# Altium project VLC.PrjPcb
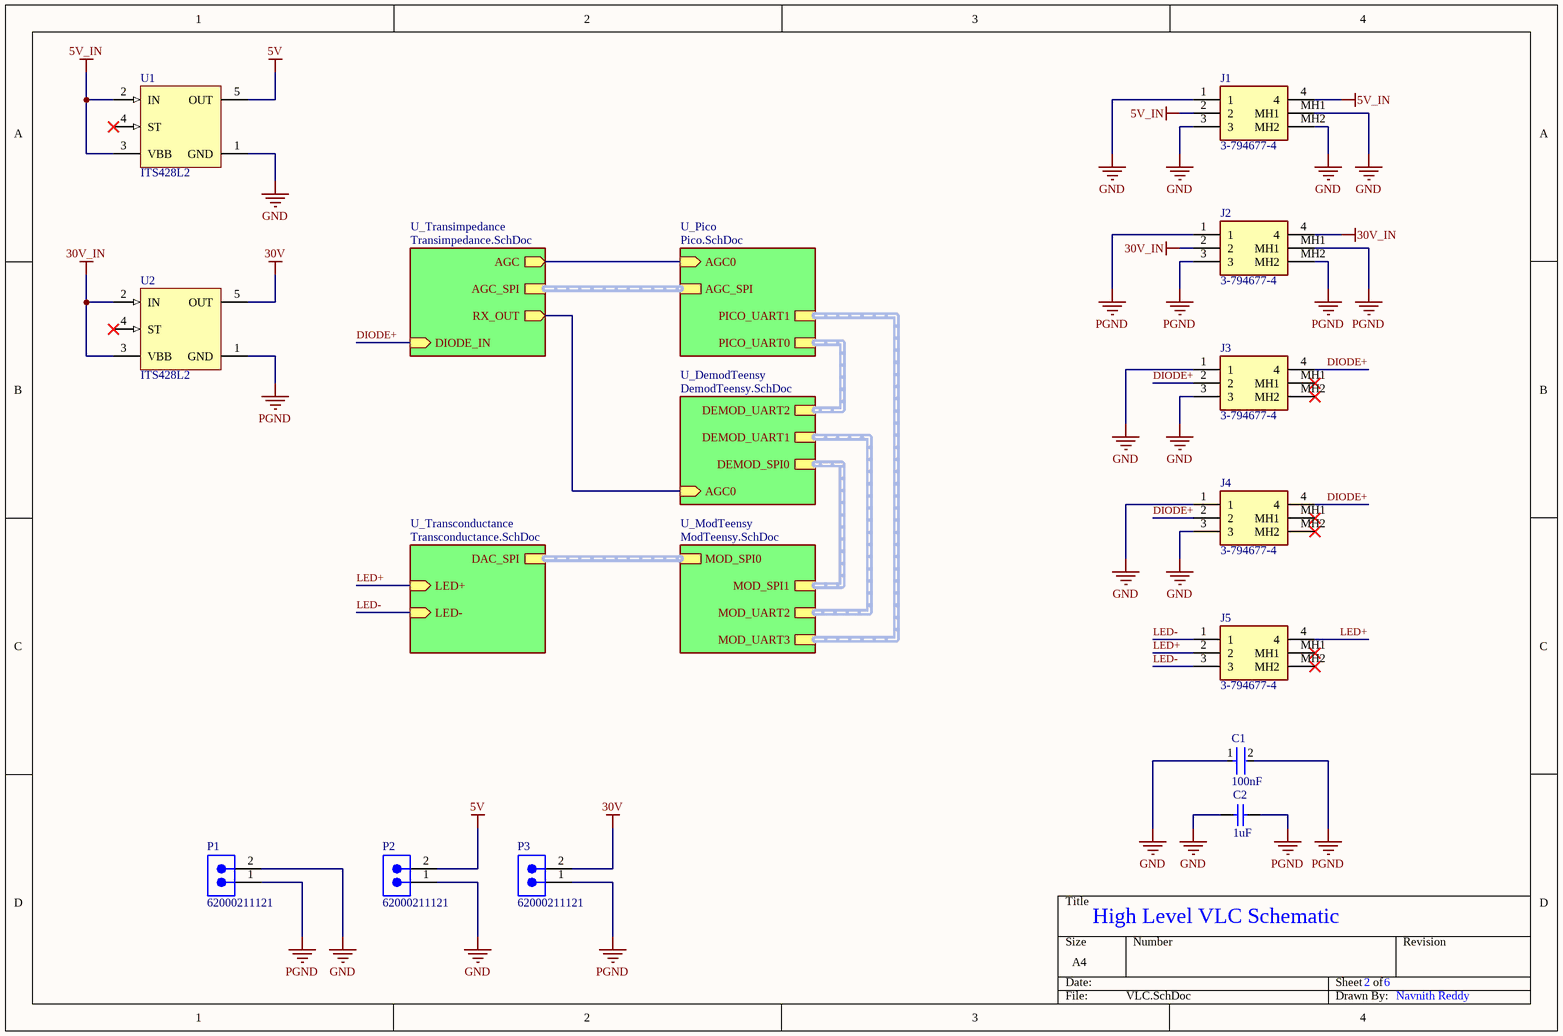
[diagram p0: VLC.SchDoc]
6 sheets, 71 parts. Net scope: hierarchical (ports join the sheet entries above them; power ports are global).
Board file: VLC.PcbDoc
Sheets:
  VLC.SchDoc
    U_Pico = Pico.SchDoc
    U_Transimpedance = Transimpedance.SchDoc
    U_DemodTeensy = DemodTeensy.SchDoc
    U_Transconductance = Transconductance.SchDoc
    U_ModTeensy = ModTeensy.SchDoc

## Sheet VLC.SchDoc
size A4; SheetNumber: 1; SheetTotal: 6

### Parts
C1  100nF  [FP-C0805C-DN-MFG]
C2  1uF  [CAPC2013X145X50LL20T25]
J1  3-794677-4  [37946774]
J2  3-794677-4  [37946774]
J3  3-794677-4  [37946774]
J4  3-794677-4  [37946774]
J5  3-794677-4  [37946774]
P1  62000211121  [62000211121]
P2  62000211121  [62000211121]
P3  62000211121  [62000211121]
U1  ITS428L2  [INF-PG-TO252-5-11_M]
U2  ITS428L2  [INF-PG-TO252-5-11_M]

### Sub-sheets
U_DemodTeensy = DemodTeensy.SchDoc: AGC0 (in), DEMOD_UART1 (harness M_UART2), DEMOD_UART2 (harness D_UART2), DEMOD_SPI0 (harness D_SPI0)
U_ModTeensy = ModTeensy.SchDoc: MOD_UART2 (harness M_UART2), MOD_UART3 (harness M_UART3), MOD_SPI0 (harness M_SPI0), MOD_SPI1 (harness M_SPI1)
U_Pico = Pico.SchDoc: AGC0 (in), PICO_UART1 (harness M_UART3), PICO_UART0 (harness D_UART2), AGC_SPI (harness PICO_SPI1)
U_Transconductance = Transconductance.SchDoc: LED+ (in), LED- (in), DAC_SPI (harness SPI)
U_Transimpedance = Transimpedance.SchDoc: AGC (out), DIODE_IN (in), AGC_SPI (harness SPI_0), RX_OUT (out)

### Nets
5V: P2.2 U1.5(OUT)
5V_IN: J1.2 J1.4 U1.2(IN) U1.3(VBB)
30V_IN: J2.2 J2.4 U2.2(IN) U2.3(VBB)
GND: C1.1 C2.2 J1.1 J1.3 J1.MH1 J1.MH2 J3.1 J3.3 J4.1 J4.3 P1.2 P2.1 U1.1(GND)
LED+: J5.2 J5.4 P3.2 U2.5(OUT) ; sheet U_Transconductance/LED+  [also labelled 30V]
PGND: C1.2 C2.1 J2.1 J2.3 J2.MH1 J2.MH2 P1.1 P3.1 U2.1(GND)
D14: sheet U_Pico/AGC0, sheet U_Transimpedance/AGC, sheet U_Transimpedance/RX_OUT, sheet U_DemodTeensy/AGC0
DIODE+: J3.2 J3.4 J4.2 J4.4 ; sheet U_Transimpedance/DIODE_IN
LED-: J5.1 J5.3 ; sheet U_Transconductance/LED-

Not connected (* = marked no-connect by the designer): J3 MH1* MH2*; J4 MH1* MH2*; J5 MH1* MH2*; U1 4(ST)*; U2 4(ST)*

### Buses and harness runs
harness sheet U_DemodTeensy/DEMOD_SPI0 = sheet U_ModTeensy/MOD_SPI1
harness sheet U_DemodTeensy/DEMOD_UART1 = sheet U_ModTeensy/MOD_UART2
harness sheet U_DemodTeensy/DEMOD_UART2 = sheet U_Pico/PICO_UART0
harness sheet U_ModTeensy/MOD_SPI0 = sheet U_Transconductance/DAC_SPI
harness sheet U_ModTeensy/MOD_UART3 = sheet U_Pico/PICO_UART1
harness sheet U_Pico/AGC_SPI = sheet U_Transimpedance/AGC_SPI

### Notes on the sheet
- High Level VLC Schematic
- 2
- 6
- Navnith Reddy

### Library data of the parts
C1 = CMP-2007-00274-2: CAP CER 0.1UF 16V X7R 0805; Manufacturer Part Number: C0805C104K4RACTU; Manufacturer: KEMET; Material: Ceramic; Tolerance: 0.1; Capacitance: 0.10 μF; Value: 0.10 μF; Temperature Coefficient: 30ppm/°C; Device Class L3: Ceramic Capacitors; RoHS: TRUE; Octopart: https://octopart.com/c0805c104k4ractu-kemet-92155; ComponentLink2Description: Datasheet; ComponentLink2URL: https://content.kemet.com/datasheets/KEM_C1003_C0G_SMD.pdf; Temperature Range High: +125°C; Category: Cap; Lead Free: Yes; Digikey Description: CAP CER 0.1UF 16V X7R 0805; Automotive: No; Temperature Range Low: -55°C; Voltage Rating: 16 V; Package: C0805C-DN; Ipc Land Pattern Name: CAPC200125X78; Height: 0.88mm; Device Class L1: Passive Components; Temperature: -55°C to +125°C; Mouser Description: Multilayer Ceramic Capacitors MLCC - SMD/SMT 16volts 0.1uF X7R 10%; Device Class L2: Capacitors; Temperature Characteristic: X7R
C2 = CMP-1036-04746-2: Manufacturer: Kemet; Part Number: C0805C105K4PACTU
J1-J5 = 3-794677-4: Connector; Manufacturer_Name: TE Connectivity; Datasheet Link: https://www.te.com/commerce/DocumentDelivery/DDEController?Action=srchrtrv&DocNm=micro-mate-n-lok-connector-qrg&DocType=Data%20Sheet&DocLang=English&PartCntxt=3-794677-4&DocFormat=pdf; Height: 8.67mm; Manufacturer_Part_Number: 3-794677-4; Mouser Part Number: 571-3-794677-4; Mouser Price/Stock: https://www.mouser.co.uk/ProductDetail/TE-Connectivity-AMP/3-794677-4?qs=6xDM53S3Z3IXPJK6%252BrOgPw%3D%3D; Arrow Part Number: 3-794677-4; Arrow Price/Stock: https://www.arrow.com/en/products/3-794677-4/te-connectivity?region=europe
P1-P3 = CMP-1502-00956-3: NexarPartId: 61924778; Number of Contacts: 2; Voltage Rating: 200V; Gender: Male; Contact Resistance: 20mΩ; Current Rating: 2A; Lead Pitch: 2mm; Max Operating Temperature: 105°C; Contact Material: Gold; Number of Rows: 1; Operating Supply Voltage: 200V; Number of Pins: 2; Orientation: Vertical; Min Operating Temperature: -40°C; Height: 6.35mm; RoHS: Non-Compliant
U1 U2 = CMP-1095-00118-1: Smart High-Side Power Switch for Industrial Applications 1 Channel: 60 mOhm Status Feedback, 4.75 to 41 V Operating, -30 to 85 degC, PG-TO252-5-11, Reel, Green; Manufacturer: Infineon; IL (nom)min - one channel active: 5.8Â A; Ptot (max): 75 W; toff (max): 200 us; Green: TRUE; RON @ 25 degC: 60 mOhm (max); Channels: 1; RON (max) @ Tj max: 120 mOhm; Operating Voltage Range (min): 4.75Â V; IL (SC): 22 A; Operating Voltage Range (max): 41 V; Diagnostic: Digital; ComponentLink2Description: Datasheet; PackageVersion: Nov-10; PartNumber: ITS428L2; PackageDescription: 5-Pin Plastic (Green) Transistor Single Outline Package, 6.5 x 6.12 mm Body, 1.14 mm Pitch; ComponentLink2URL: http://www.infineon.com/dgdl/ITS428L2_DS11_20081010.pdf?folderId=db3a304314dca389011537739e37155f&fileId=db3a30431c69a49d011cdcc9a1fd41df; DatasheetVersion: Rev. 1.1; IL (nom)min - all channels active: 5.8Â A; PackageReference: PG-TO252-5-11; ton (max): 200 us; Mounting Technology: Surface Mount; ComponentLink3Description: Package Specification; Load Current (typ): 5.8Â A; Packing: Reel; Halogen-free: TRUE; ComponentLink1Description: Manufacturer URL; ComponentLink1URL: http://www.infineon.com/; ComponentLink3URL: http://www.infineon.com/dgdl/TLE7276-Data+Sheet-+v1_11.pdf?folderId=db3a304412b407950112b408e8c90004&fileId=db3a304412b407950112b436c53f66c8&sId=db3a30433db6f09f013dc0e43c0428c1; IL (SCp): 22 A

## Sheet Pico.SchDoc
size A4; SheetNumber: 4; SheetTotal: 6
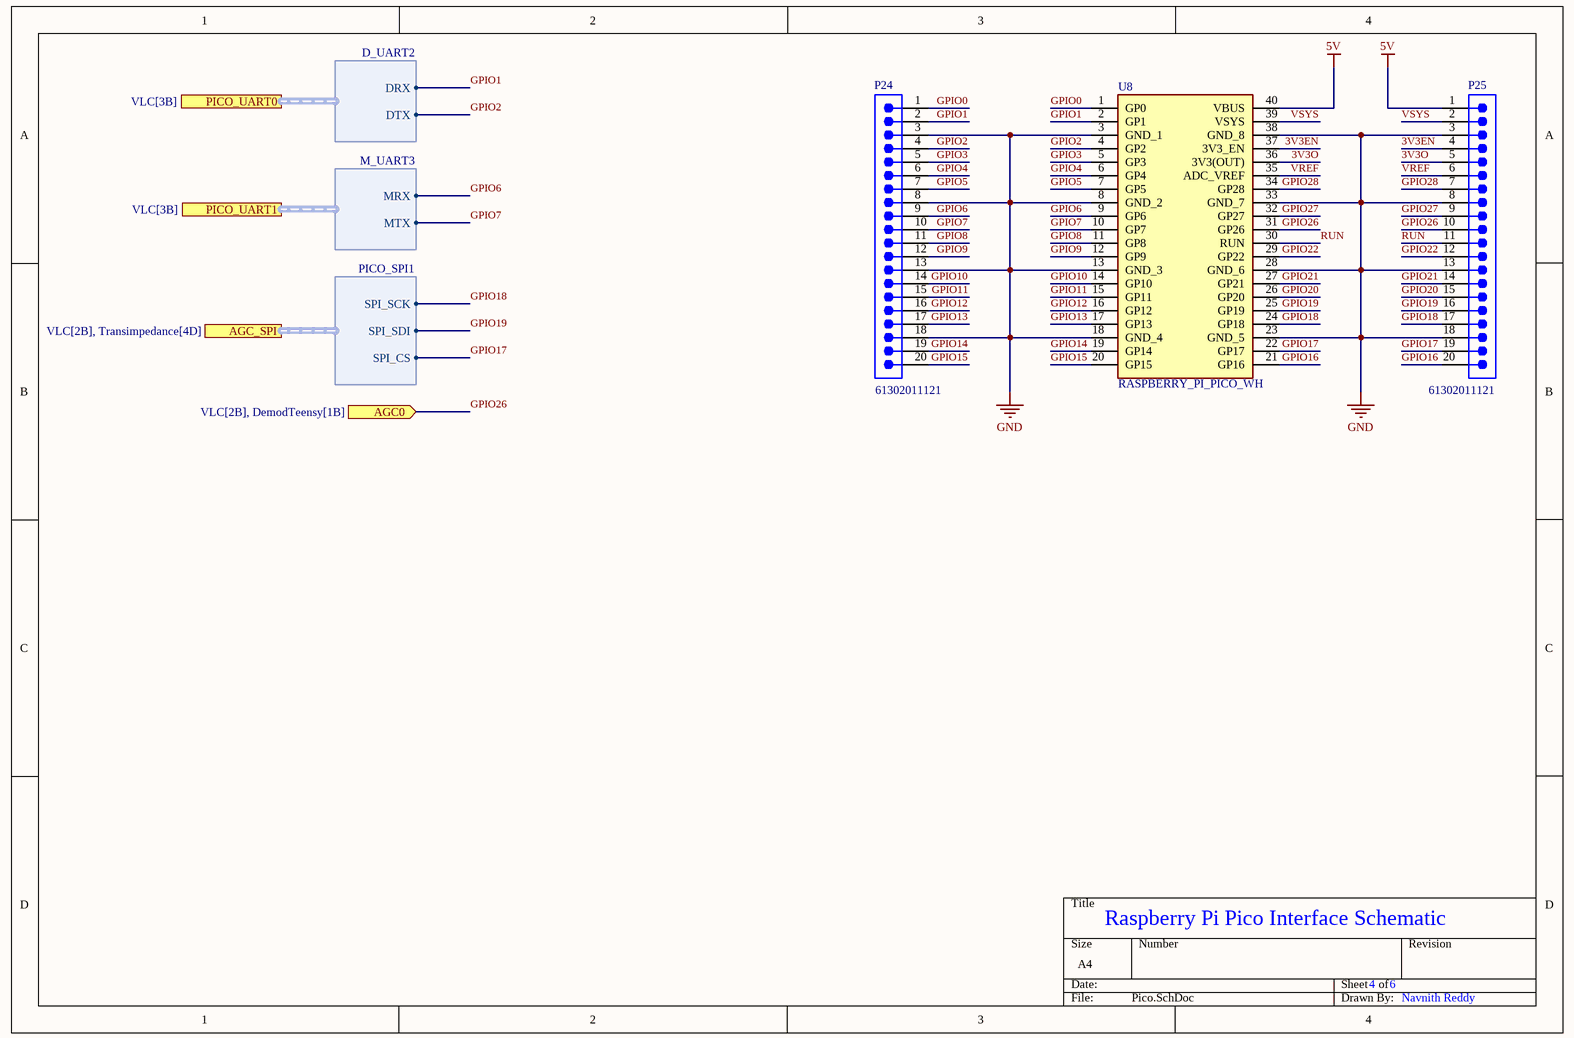
[diagram p1: Pico.SchDoc]

### Parts
P24  61302011121  [61302011121]
P25  61302011121  [61302011121]
U8  RASPBERRY_PI_PICO_WH  [RASPBERRYPIPICOWH]

### Ports
AGC0 (in, see VLC[2B], DemodTeensy[1B]), AGC_SPI (harness PICO_SPI1, see VLC[2B], Transimpedance[4D]), PICO_UART0 (harness D_UART2, see VLC[3B]), PICO_UART1 (harness M_UART3, see VLC[3B])

### Harnesses
PICO_SPI1: SPI_SCK, SPI_SDI, SPI_CS
M_UART3: MRX, MTX
D_UART2: DRX, DTX

### Nets
5V: P25.1 U8.40(VBUS)
GND: P24.3 P24.8 P24.13 P24.18 P25.3 P25.8 P25.13 P25.18 U8.3(GND_1) U8.8(GND_2) U8.13(GND_3) U8.18(GND_4) U8.23(GND_5) U8.28(GND_6) U8.33(GND_7) U8.38(GND_8)
3V3EN: P25.4 U8.37(3V3_EN)
3V3O: P25.5 U8.36(3V3(OUT))
GPIO0: P24.1 U8.1(GP0)
GPIO1: P24.2 U8.2(GP1) ; port PICO_UART0.DRX  [project net D7]
GPIO2: P24.4 U8.4(GP2) ; port PICO_UART0.DTX  [project net D8]
GPIO3: P24.5 U8.5(GP3)
GPIO4: P24.6 U8.6(GP4)
GPIO5: P24.7 U8.7(GP5)
GPIO6: P24.9 U8.9(GP6) ; port PICO_UART1.MRX
GPIO7: P24.10 U8.10(GP7) ; port PICO_UART1.MTX
GPIO8: P24.11 U8.11(GP8)
GPIO9: P24.12 U8.12(GP9)
GPIO10: P24.14 U8.14(GP10)
GPIO11: P24.15 U8.15(GP11)
GPIO12: P24.16 U8.16(GP12)
GPIO13: P24.17 U8.17(GP13)
GPIO14: P24.19 U8.19(GP14)
GPIO15: P24.20 U8.20(GP15)
GPIO16: P25.20 U8.21(GP16)
GPIO17: P25.19 U8.22(GP17) ; port AGC_SPI.SPI_CS
GPIO18: P25.17 U8.24(GP18) ; port AGC_SPI.SPI_SCK
GPIO19: P25.16 U8.25(GP19) ; port AGC_SPI.SPI_SDI
GPIO20: P25.15 U8.26(GP20)
GPIO21: P25.14 U8.27(GP21)
GPIO22: P25.12 U8.29(GP22)
GPIO26: P25.10 U8.31(GP26) ; port AGC0  [project net D14]
GPIO27: P25.9 U8.32(GP27)
GPIO28: P25.7 U8.34(GP28)
RUN: P25.11 U8.30(RUN)
VREF: P25.6 U8.35(ADC_VREF)
VSYS: P25.2 U8.39(VSYS)

### Notes on the sheet
- Raspberry Pi Pico Interface Schematic
- 4
- 6
- Navnith Reddy

### Library data of the parts
P24 P25 = CMP-1502-01102-2: NexarPartId: 32855554; Number of Contacts: 20; Contact Resistance: 20mΩ; Pitch: 2.54mm; Gender: Male; Operating Supply Voltage: 250V; Connector Type: Male Pin; Current Rating: 3A; Packaging: Bulk; RoHS: Compliant; Contact Material: Copper; Contact Mating Length: 5.9944mm; Number of Positions: 20; Orientation: Vertical; Termination: Solder; Number of Pins: 20; Color: Black; REACH SVHC: Unknown; Mount: Through Hole; Contact Plating: Gold; Number of Rows: 1; Lead Pitch: 2.54mm
U8 = RASPBERRY_PI_PICO_WH: Undefined or Miscellaneous; Manufacturer_Name: RASPBERRY-PI; Manufacturer_Part_Number: RASPBERRY PI PICO WH; Datasheet Link: https://datasheets.raspberrypi.com/picow/pico-w-datasheet.pdf; Height: 4mm

## Sheet Transimpedance.SchDoc
size A4; SheetNumber: 6; SheetTotal: 6
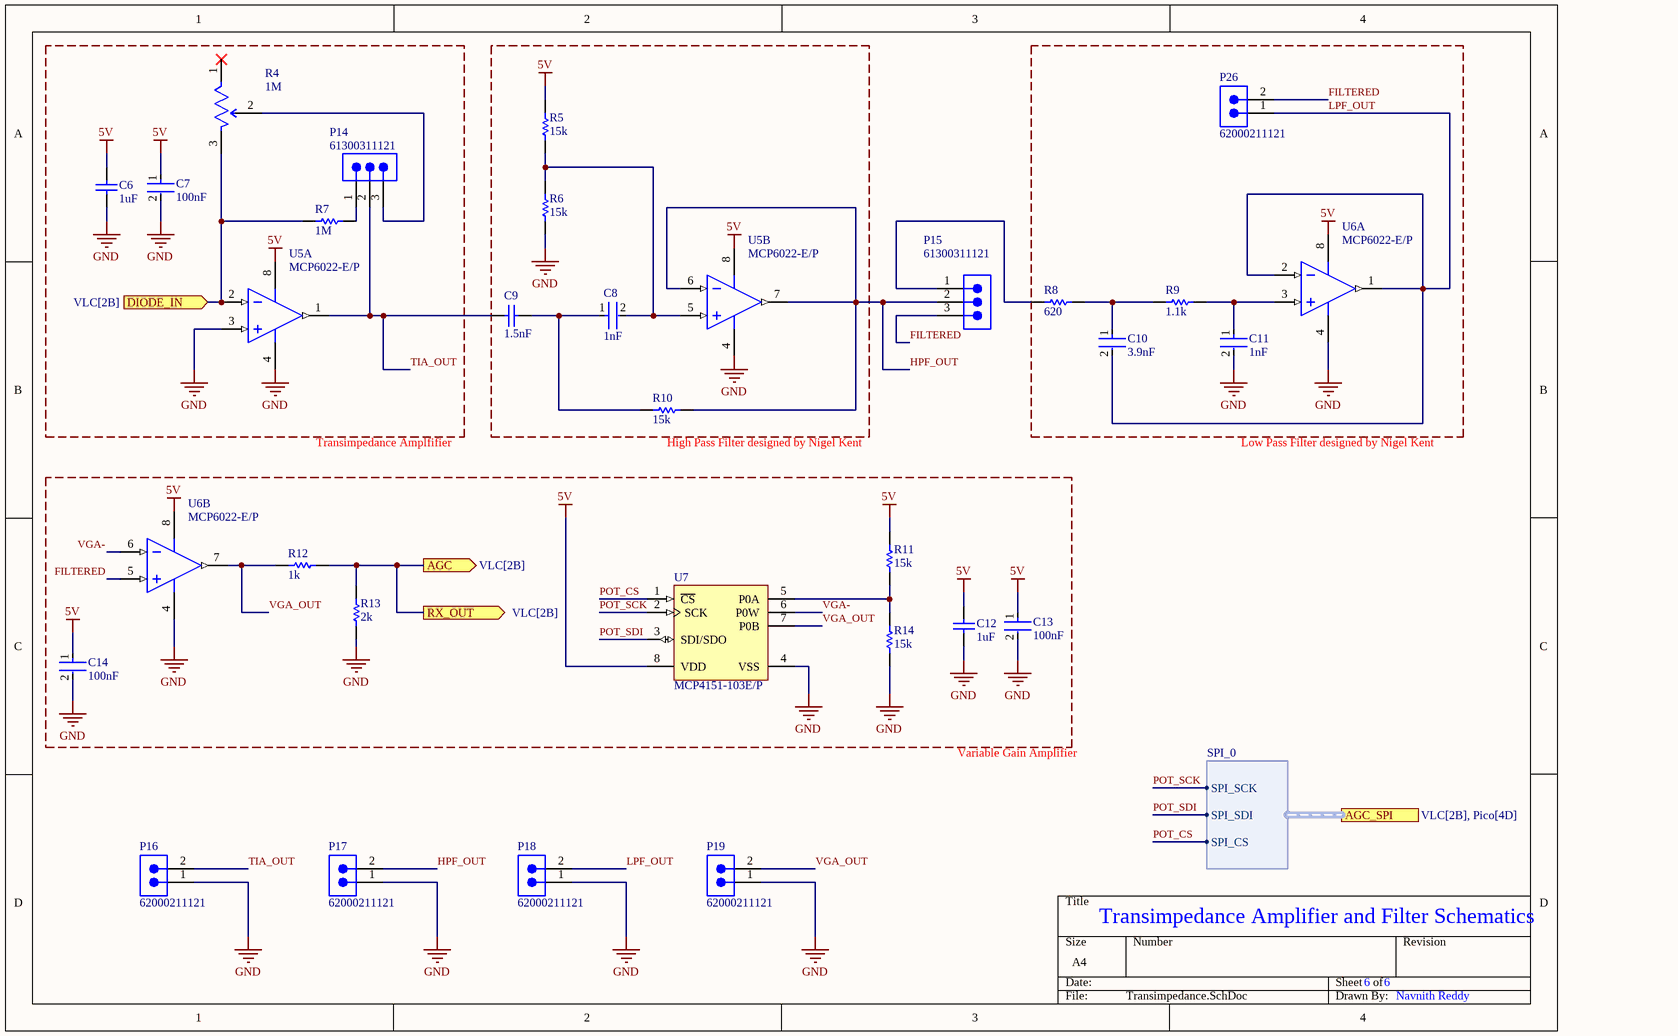
[diagram p2: Transimpedance.SchDoc]

### Parts
C6  1uF  [CAPC2013X145X50LL20T25]
C7  100nF  [FP-C0805C-DN-MFG]
C8  1nF  [FP-0805-L_2_01_0_2-W_1_25-IPC_C]
C9  1.5nF  [CAPC2013X94X50ML20T25]
C10  3.9nF  [FP-C0805C-DN-MFG]
C11  1nF  [FP-0805-L_2_01_0_2-W_1_25-IPC_C]
C12  1uF  [CAPC2013X145X50LL20T25]
C13  100nF  [FP-C0805C-DN-MFG]
C14  100nF  [FP-C0805C-DN-MFG]
P14  61300311121  [61300311121]
P15  61300311121  [61300311121]
P16  62000211121  [62000211121]
P17  62000211121  [62000211121]
P18  62000211121  [62000211121]
P19  62000211121  [62000211121]
P26  62000211121  [62000211121]
R4  1M  [FP-3296W-MFG]
R5  15k  [RESC2013X55X40NL15T20]
R6  15k  [RESC2013X55X40NL15T20]
R7  1M  [RESC2013X60X40LL20T25]
R8  620  [RESC2013X70X40LL20T20]
R9  1.1k  [RESC2013X50X30LL20T20]
R10  15k  [RESC2013X55X40NL15T20]
R11  15k  [RESC2013X55X40NL15T20]
R12  1k  [RESC2013X70X40ML20T20]
R13  2k  [RESC2013X70X40ML20T20]
R14  15k  [RESC2013X55X40NL15T20]
U5  MCP6022-E/P  [PDIP300-P8]  (parts A,B of 2)
U6  MCP6022-E/P  [PDIP300-P8]  (parts A,B of 2)
U7  MCP4151-103E/P  [PDIP300-P8]

### Ports
AGC (out, see VLC[2B]), AGC_SPI (harness SPI_0, see VLC[2B], Pico[4D]), DIODE_IN (in, see VLC[2B]), RX_OUT (out, see VLC[2B])

### Harnesses
SPI_0: SPI_SCK, SPI_SDI, SPI_CS

### Nets
5V: C6.2 C7.1 C12.2 C13.1 C14.1 R5.2 R11.2 U5.8(VDD) U6.8(VDD) U7.8(VDD)
GND: C6.1 C7.2 C11.2 C12.1 C13.2 C14.2 P16.1 P17.1 P18.1 P19.1 R6.1 R13.1 R14.1 U5.3(VINA+) U5.4(VSS) U6.4(VSS) U7.4(VSS)
D14: R12.2 R13.2 ; port AGC, port RX_OUT
DIODE+: R4.3(CW) R7.1 U5.2(VINA-) ; port DIODE_IN
FILTERED: P15.3 P26.2 U6.5(VINB+)
HPF_OUT: P15.2 P17.2 R10.2 U5.6(VINB-) U5.7(VOUTB)
LPF_OUT: C10.2 P18.2 P26.1 U6.1(VOUTA) U6.2(VINA-)
POT_CS: U7.1(~{CS}) ; port AGC_SPI.SPI_CS  [project net GPIO17]
POT_SCK: U7.2(SCK) ; port AGC_SPI.SPI_SCK  [project net GPIO18]
POT_SDI: U7.3(SDI/SDO) ; port AGC_SPI.SPI_SDI  [project net GPIO19]
TIA_OUT: C9.1 P14.2 P16.2 U5.1(VOUTA)
VGA-: U6.6(VINB-) U7.6(P0W)
VGA_OUT: P19.2 R12.1 U6.7(VOUTB) U7.7(P0B)
NetC8_1: C8.1 C9.2 R10.1
NetC8_2: C8.2 R5.1 R6.2 U5.5(VINB+)
NetC10_1: C10.1 R8.2 R9.1
NetC11_1: C11.1 R9.2 U6.3(VINA+)
NetP14_1: P14.1 R7.2
NetP14_3: P14.3 R4.2(WIPER)
NetP15_1: P15.1 R8.1
NetR11_1: R11.1 R14.2 U7.5(P0A)

Not connected (* = marked no-connect by the designer): R4 1(CCW)*

### Notes on the sheet
- Transimpedance Amplfifier
- (near R10) High Pass Filter designed by Nigel Kent
- Low Pass Filter designed by Nigel Kent
- Variable Gain Amplifier
- Transimpedance Amplifier and Filter Schematics
- 6
- Navnith Reddy

### Library data of the parts
C6 C12 = CMP-1036-04746-2: as C2 on sheet VLC
C7 C13 C14 = CMP-2007-00274-2: as C1 on sheet VLC; Device Class L3: Ceramic Capacitors; RoHS: TRUE; Octopart: https://octopart.com/c0805c104k4ractu-kemet-92155; ComponentLink2Description: Datasheet; ComponentLink2URL: https://content.kemet.com/datasheets/KEM_C1003_C0G_SMD.pdf; Temperature Range High: +125°C; Category: Cap; Lead Free: Yes; Digikey Description: CAP CER 0.1UF 16V X7R 0805; Automotive: No; Temperature Range Low: -55°C; Voltage Rating: 16 V; Package: C0805C-DN; Ipc Land Pattern Name: CAPC200125X78; Height: 0.88mm; Device Class L1: Passive Components; Temperature: -55°C to +125°C; Mouser Description: Multilayer Ceramic Capacitors MLCC - SMD/SMT 16volts 0.1uF X7R 10%; Device Class L2: Capacitors; Temperature Characteristic: X7R
C8 C11 = CMP-1036-02979-3: General Purpose Ceramic Capacitor, 0805, 1nF, 10%, X7R, 0.15, 50V; Dissipation Factor: 2.5%; Insulation Resistance: 100GR; Radiation Hardening: No; Case Code (Imperial): 0805; Packaging: Tape and Reel; Height: 0.94mm; Number of Pins: 2; REACH SVHC: No SVHC; Case Code (Metric): 2012; Voltage: 50V; Max Operating Temperature: 125°C; Tolerance: 10%; Voltage Rating: 50V; Depth: 1.25mm; Voltage Rating (DC): 50V; Thickness: 0.037inch; Termination: SMD/SMT; Package Quantity: 1; RoHS Compliant: Yes; Mount: Surface Mount; Dielectric: X7R; Length: 2.01mm; Contact Plating: Tin; Lead Free: Lead Free; Case/Package: 0805; Width: 1.25mm; Capacitance: 1nF; Dielectric Material: Ceramic; Min Operating Temperature: -55°C
C9 = CMP-2007-04179-1: Manufacturer: AVX Interconnect / Elco; Part Number: 08051C152KAT2A
C10 = CMP-2007-03730-2: CAP CER 3900PF 200V C0G/NP0 0805; Manufacturer Part Number: C0805C392J2GACAUTO; Manufacturer: KEMET; Temperature Characteristic: C0G; Value: 3,900 pF; Material: Ceramic; Tolerance: 0.05; Temperature Coefficient: 30ppm/°C; Category: Cap; Lead Free: Yes; Device Class L1: Passive Components; Temperature Range Low: -55°C; Temperature Range High: +125°C; Height: 0.88mm; Voltage Rating: 200 V; Device Class L2: Capacitors; Octopart: https://octopart.com/c0805c392j2gacauto-kemet-46733246; Capacitance: 3,900 pF; Temperature: -55°C to +125°C; Ipc Land Pattern Name: CAPC200125X78; Automotive: No; Digikey Description: CAP CER 3900PF 200V C0G/NP0 0805; ComponentLink2URL: https://content.kemet.com/datasheets/KEM_C1003_C0G_SMD.pdf; Device Class L3: Ceramic Capacitors; Package: C0805C-DN; RoHS: TRUE; ComponentLink2Description: Datasheet
P14 P15 = CMP-1502-01062-2: NexarPartId: 32855521; Voltage Rating: 250V; Current Rating: 3A; Connector Type: Male Pin; Number of Positions: 3; Gender: Male; Contact Resistance: 20mΩ; Pitch: 2.54mm; Max Operating Temperature: 105°C; Lead Pitch: 2.54mm; Lead Free: Lead Free; Contact Mating Length: 5.9944mm; Contact Material: Copper; Number of Pins: 3; Orientation: Vertical; Height: 8.94mm; Packaging: Bulk; Min Operating Temperature: -40°C; Mount: Through Hole; RoHS: Compliant; Number of Contacts: 3; Operating Supply Voltage: 250V; Termination: Solder; Number of Rows: 1; Contact Plating: Gold; Color: Black; REACH SVHC: Unknown
P16-P19 P26 = CMP-1502-00956-3: as P1 on sheet VLC; Lead Pitch: 2mm; Max Operating Temperature: 105°C; Contact Material: Gold; Number of Rows: 1; Operating Supply Voltage: 200V; Number of Pins: 2; Orientation: Vertical; Min Operating Temperature: -40°C; Height: 6.35mm; RoHS: Non-Compliant
R4 = CMP-07234-000048-1: TRIMMER 200K OHM 0.5W PC PIN TOP; Resistance Tolerance: 10%; Number of Turns: 25; Temperature Coefficient: 100ppm/°C; Power Rating: 500mW; Resistance: 200kR; Resistor Type: Cermet; Color: Blue; Radiation Hardening: No; RoHS Compliant: Yes; Taper: Linear; Technology: CERMET; Mount: Panel; Packaging: Rail/Tube; Lead Free: Lead Free; Tolerance: 10%; Min Operating Temperature: -55°C; Depth: 4.83mm; Length: 9.53mm; Width: 9.53mm; REACH SVHC: No SVHC; Package Quantity: 50; Height: 0.395inch; Max Power Dissipation: 500mW; Max Operating Temperature: 125°C; Military Standard: Not; Termination: Pin; Contact Plating: Tin; Series: 3296; Weight: 0.03oz
R5 R6 R10 R11 R14 = CMP-2001-04735-1: Part Number: TNPW080515K0BEEA; Manufacturer: Vishay Dale
R7 = CMP-2001-00584-1: Part Number: ERA-6AEB105V; Manufacturer: Panasonic
R8 = CMP-2001-00436-1: Manufacturer: Panasonic; Part Number: ERJ-6GEYJ621V
R9 = CMP-1013-00514-2: Part Number: CRCW08051K10FKTA; Manufacturer: Vishay Dale
R12 = CMP-2001-04375-5: Chip Resistor, 1 KOhm, +/- 1%, 0.125 W, -55 to 155 degC, 0805 (2012 Metric), RoHS, Tape and Reel; Manufacturer: Panasonic; Voltage Rating: 150 V; ComponentLink1URL: http://www.panasonic.com/; ComponentLink2Description: Datasheet; REACH SVHC: Yes; ComponentLink1Description: Manufacturer URL; Length: 2 mm; Height: 0.6 mm; Package Quantity: 1; PackageDescription: 2-Pin Surface Mount Device, Body 2 x 1.25 mm; Packaging: Cut Tape; PackageReference: 0805; Max Operating Temperature: 155 degC; Mounting Technology: Surface Mount; ComponentLink2URL: http://industrial.panasonic.com/cdbs/www-data/pdf/RDA0000/AOA0000C86.pdf; DatasheetVersion: 04/2015; Min Operating Temperature: -55 degC; RoHSCompliant: true; Mount: Surface Mount
R13 = CMP-2001-00370-1: Part Number: ERJ-6GEYJ202V; Manufacturer: Panasonic
U5 U6 = CMP-0187-00090-3: None; Max Supply Voltage: 5.5V; Voltage Gain: 110dB; Input Bias Current: 5nA; Bandwidth: 10MHz; Number of Elements: 2; Min Supply Voltage: 2.5V; Input Offset Voltage-Max: 500uV; Power Supply Rejection Ratio (PSRR): 74dB; Nominal Supply Current: 1mA; Input Offset Voltage (Vos): 250uV; Amplifier Type: GENERAL PURPOSE; Common Mode Rejection Ratio: 70dB; Slew Rate-Nom: 7V/µs; Output Current: 22mA; Max Operating Temperature: 125°C; REACH SVHC: No SVHC; Height: 0.195inch; Length: 0.4inch; Min Operating Temperature: -40°C; Mount: Through Hole; Number of Amplifiers: 2; Harmonic Distortion: 0.00053%; Gain Bandwidth Product: 10MHz; RoHS Compliant: Yes; Unity Gain Bandwidth Product: 10MHz; Number of Channels: 2; Radiation Hardening: No; Technology: CMOS; Supply Current: 1mA; Package Quantity: 60; Lead Free: Lead Free; Width: 0.28inch; Slew Rate: 7V/µs; Case/Package: PDIP; Packaging: Rail/Tube; Number of Pins: 8; Number of Circuits: 2
U7 = CMP-0188-00257-2: 7/8-Bit Single/Dual SPI Digital POT with Volatile Memory, 8-Pin PDIP, Extended Temperature; RevisionNote: URLs added.; PackageReference: PDIP300-P8; ComponentLink1Description: Manufacturer URL; ComponentLink3URL: http://www.microchip.com/stellent/groups/techpub_sg/documents/packagingspec/en012702.pdf; PackageDescription: 8-Lead Plastic Dual In-Line (P) - 300 mil Body [PDIP]; ComponentLink2Description: Datasheet; Code_JEDEC: MS-001; ComponentLink2URL: http://ww1.microchip.com/downloads/en/DeviceDoc/22060b.pdf; DatasheetVersion: revB, Dec-2008; ComponentLink1URL: http://www.microchip.com/; ComponentLink3Description: Package Specification; PackageVersion: revBB, Aug-2009

## Sheet DemodTeensy.SchDoc
size A4; SheetNumber: 3; SheetTotal: 6
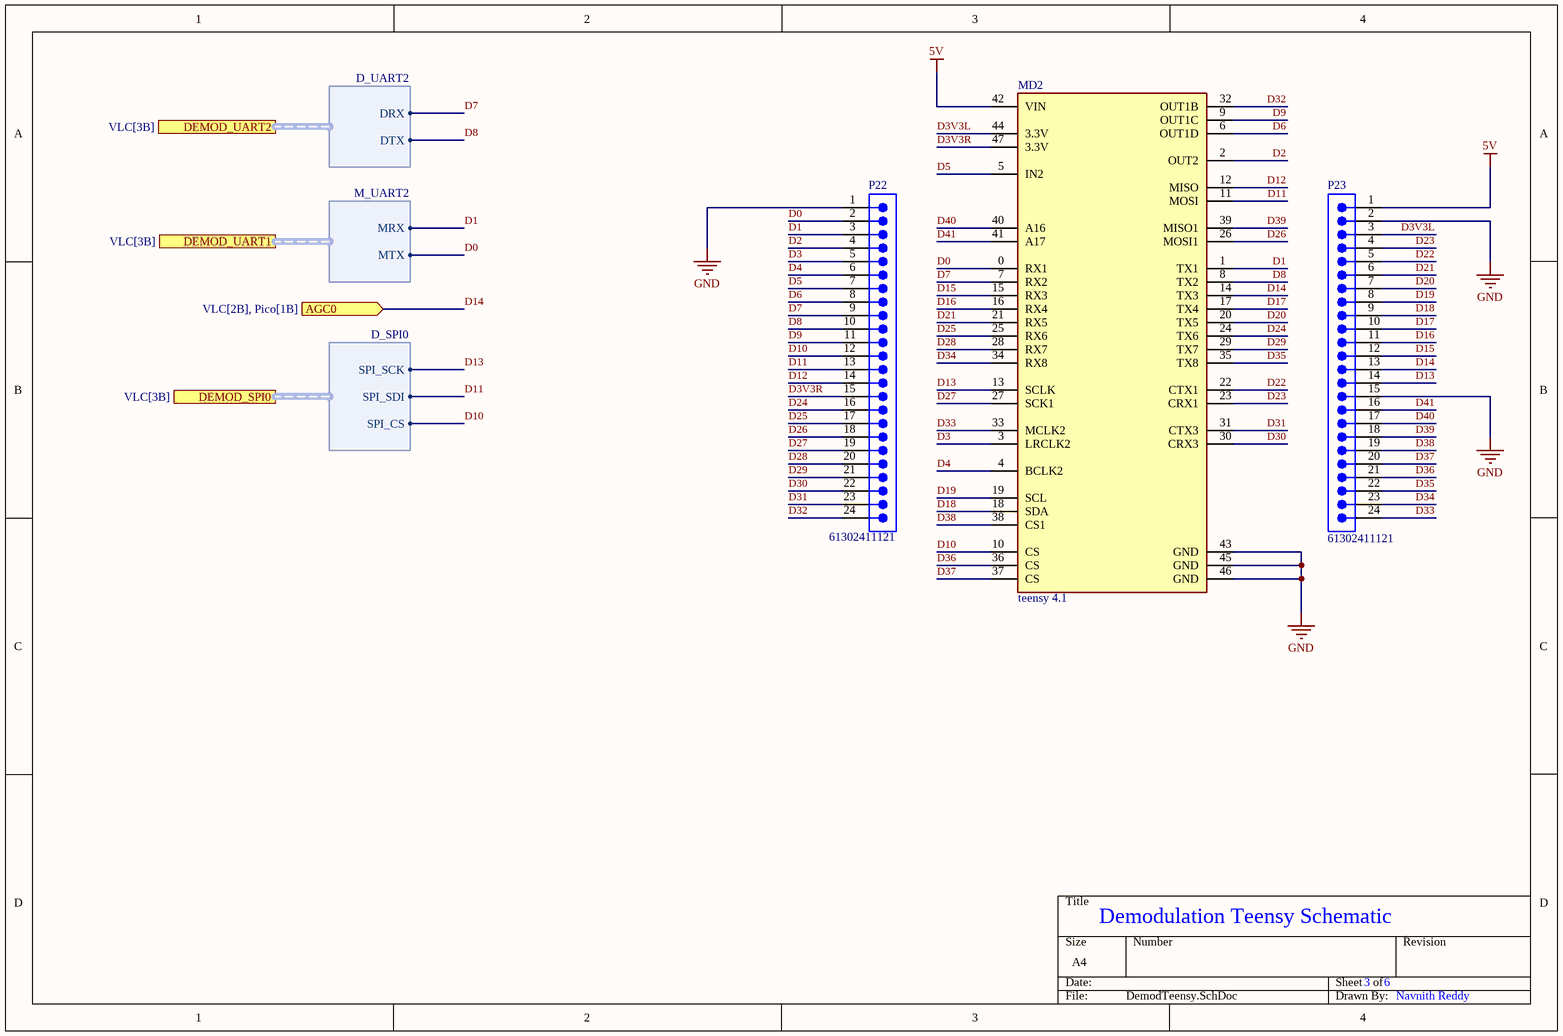
[diagram p3: DemodTeensy.SchDoc]

### Parts
MD2  teensy 4.1  [FP-DEV-16996-MFG]
P22  61302411121  [61302411121]
P23  61302411121  [61302411121]

### Ports
AGC0 (in, see VLC[2B], Pico[1B]), DEMOD_SPI0 (harness D_SPI0, see VLC[3B]), DEMOD_UART1 (harness M_UART2, see VLC[3B]), DEMOD_UART2 (harness D_UART2, see VLC[3B])

### Harnesses
D_SPI0: SPI_SCK, SPI_SDI, SPI_CS
M_UART2: MRX, MTX
D_UART2: DRX, DTX

### Nets
5V: MD2.42(VIN) P23.1
GND: MD2.43(GND) MD2.45(GND) MD2.46(GND) P22.1 P23.2 P23.15
D0: MD2.0(RX1) P22.2 ; port DEMOD_UART1.MTX
D1: MD2.1(TX1) P22.3 ; port DEMOD_UART1.MRX
D2: MD2.2(OUT2) P22.4
D3: MD2.3(LRCLK2) P22.5
D3V3L: MD2.44(3.3V) P23.3
D3V3R: MD2.47(3.3V) P22.15
D4: MD2.4(BCLK2) P22.6
D5: MD2.5(IN2) P22.7
D6: MD2.6(OUT1D) P22.8
D7: MD2.7(RX2) P22.9 ; port DEMOD_UART2.DRX
D8: MD2.8(TX2) P22.10 ; port DEMOD_UART2.DTX
D9: MD2.9(OUT1C) P22.11
D10: MD2.10(CS) P22.12 ; port DEMOD_SPI0.SPI_CS
D11: MD2.11(MOSI) P22.13 ; port DEMOD_SPI0.SPI_SDI
D12: MD2.12(MISO) P22.14
D13: MD2.13(SCLK) P23.14 ; port DEMOD_SPI0.SPI_SCK
D14: MD2.14(TX3) P23.13 ; port AGC0
D15: MD2.15(RX3) P23.12
D16: MD2.16(RX4) P23.11
D17: MD2.17(TX4) P23.10
D18: MD2.18(SDA) P23.9
D19: MD2.19(SCL) P23.8
D20: MD2.20(TX5) P23.7
D21: MD2.21(RX5) P23.6
D22: MD2.22(CTX1) P23.5
D23: MD2.23(CRX1) P23.4
D24: MD2.24(TX6) P22.16
D25: MD2.25(RX6) P22.17
D26: MD2.26(MOSI1) P22.18
D27: MD2.27(SCK1) P22.19
D28: MD2.28(RX7) P22.20
D29: MD2.29(TX7) P22.21
D30: MD2.30(CRX3) P22.22
D31: MD2.31(CTX3) P22.23
D32: MD2.32(OUT1B) P22.24
D33: MD2.33(MCLK2) P23.24
D34: MD2.34(RX8) P23.23
D35: MD2.35(TX8) P23.22
D36: MD2.36(CS) P23.21
D37: MD2.37(CS) P23.20
D38: MD2.38(CS1) P23.19
D39: MD2.39(MISO1) P23.18
D40: MD2.40(A16) P23.17
D41: MD2.41(A17) P23.16

### Notes on the sheet
- Demodulation Teensy Schematic
- 3
- 6
- Navnith Reddy

### Library data of the parts
MD2 = CMP-157412-000001-1: TEENSY 4.1 (HEADERS)
P22 P23 = CMP-1502-01109-2: NexarPartId: 32855561; Number of Contacts: 24; Connector Type: Male Pin; Operating Supply Voltage: 250V; Pitch: 2.54mm; Gender: Male; Current Rating: 3A; Contact Resistance: 20mΩ; Mount: Through Hole; Contact Plating: Gold; Lead Pitch: 2.54mm; Orientation: Vertical; Color: Black; Packaging: Bulk; REACH SVHC: Unknown; Termination: Solder; Number of Positions: 24; RoHS: Compliant; Contact Mating Length: 5.9944mm; Number of Pins: 24; Contact Material: Copper; Number of Rows: 1

## Sheet Transconductance.SchDoc
size A4; SheetNumber: 5; SheetTotal: 6
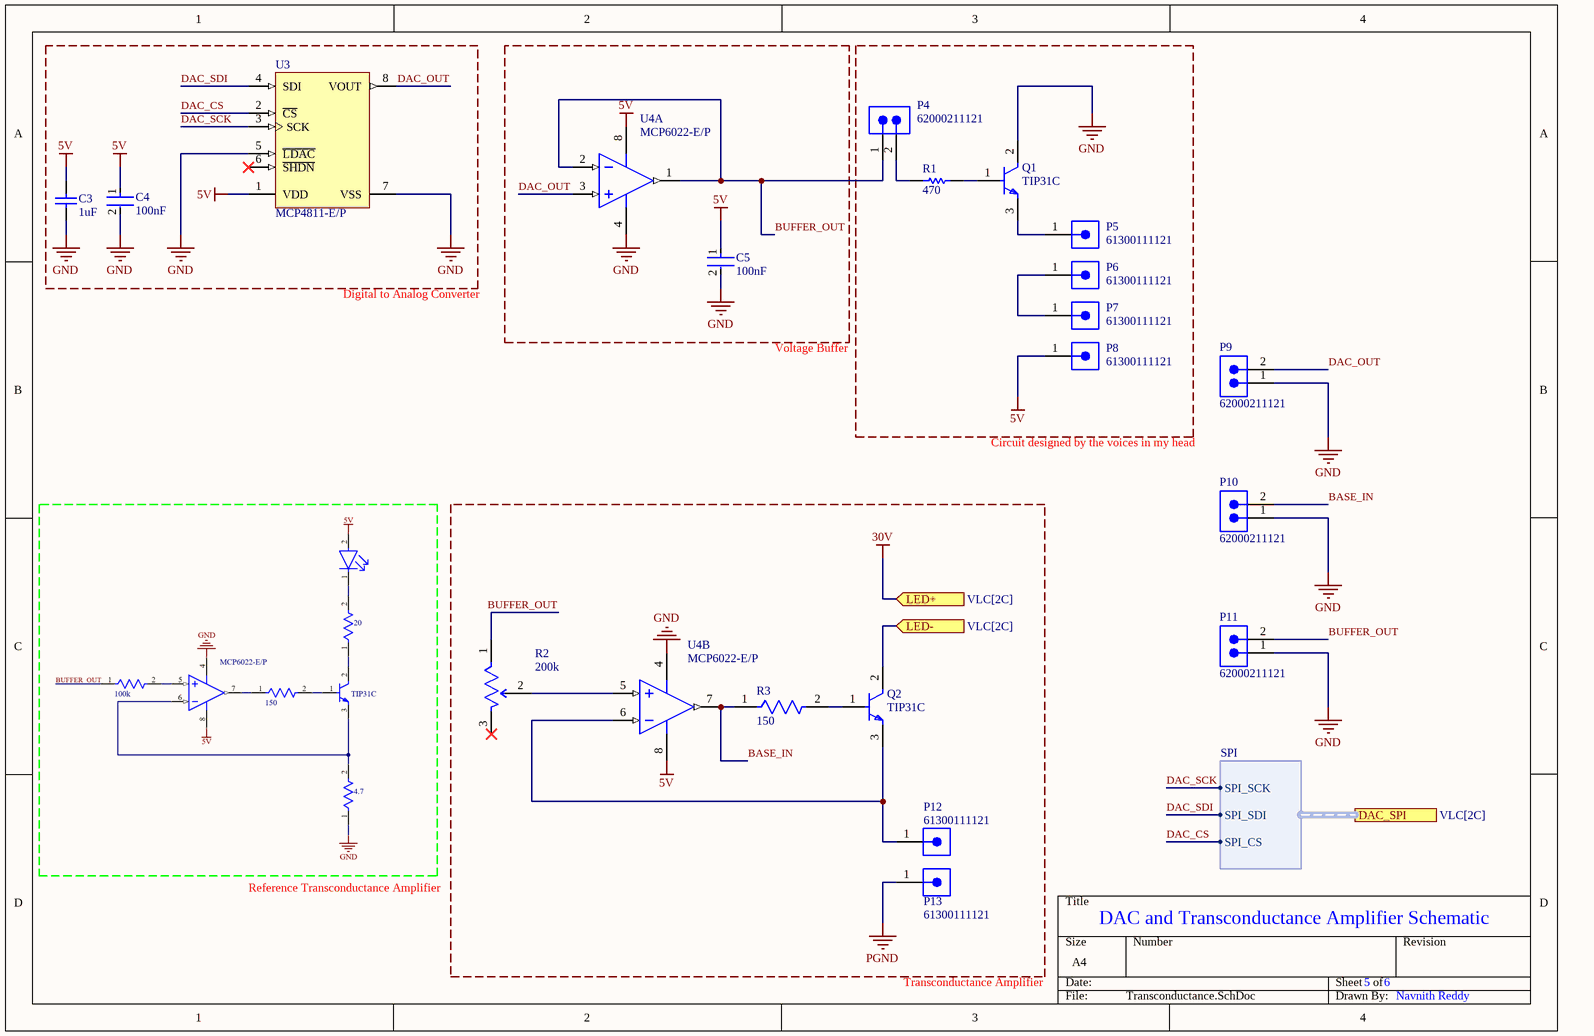
[diagram p4: Transconductance.SchDoc]

### Parts
C3  1uF  [CAPC2013X145X50LL20T25]
C4  100nF  [FP-C0805C-DN-MFG]
C5  100nF  [FP-C0805C-DN-MFG]
P4  62000211121  [62000211121]
P5  61300111121  [61300111121]
P6  61300111121  [61300111121]
P7  61300111121  [61300111121]
P8  61300111121  [61300111121]
P9  62000211121  [62000211121]
P10  62000211121  [62000211121]
P11  62000211121  [62000211121]
P12  61300111121  [61300111121]
P13  61300111121  [61300111121]
Q1  TIP31C  [FP-TO-220-P0A0015988-MFG]
Q2  TIP31C  [FP-TO-220-P0A0015988-MFG]
R1  470  [RESC2013X50X30LL20T20]
R2  200k  [FP-3296W-MFG]
R3  150  [FP-CRCW0805-e3-IPC_A]
U3  MCP4811-E/P  [PDIP300-P8]
U4  MCP6022-E/P  [PDIP300-P8]  (parts A,B of 2)

### Ports
DAC_SPI (harness SPI, see VLC[2C]), LED+ (in, see VLC[2C]), LED- (in, see VLC[2C])

### Harnesses
SPI: SPI_SCK, SPI_SDI, SPI_CS

### Nets
5V: C3.2 C4.1 C5.1 P8.1 U3.1(VDD) U4.8(VDD)
GND: C3.1 C4.2 C5.2 P9.1 P10.1 P11.1 Q1.2(C) U3.5(~{LDAC}) U3.7(VSS) U4.4(VSS)
PGND: P13.1
BASE_IN: P10.2 R3.1 U4.7(VOUTB)
BUFFER_OUT: P4.1 P11.2 R2.1(CCW) U4.1(VOUTA) U4.2(VINA-)
DAC_CS: U3.2(~{CS}) ; port DAC_SPI.SPI_CS
DAC_OUT: P9.2 U3.8(VOUT) U4.3(VINA+)
DAC_SCK: U3.3(SCK) ; port DAC_SPI.SPI_SCK
DAC_SDI: U3.4(SDI) ; port DAC_SPI.SPI_SDI
LED-: Q2.2(C) ; port LED-
NetP4_2: P4.2 R1.1
NetP5_1: P5.1 Q1.3(E)
NetP6_1: P6.1 P7.1
NetP12_1: P12.1 Q2.3(E) U4.6(VINB-)
NetQ1_1: Q1.1(B) R1.2
NetQ2_1: Q2.1(B) R3.2
NetR2_2: R2.2(WIPER) U4.5(VINB+)

Not connected (* = marked no-connect by the designer): R2 3(CW)*; U3 6(~{SHDN})*

### Notes on the sheet
- Digital to Analog Converter
- Voltage Buffer
- Circuit designed by the voices in my head
- Reference Transconductance Amplifier
- DAC and Transconductance Amplifier Schematic
- Transconductance Amplifier
- 5
- 6
- Navnith Reddy

### Library data of the parts
C3 = CMP-1036-04746-2: as C2 on sheet VLC
C4 C5 = CMP-2007-00274-2: as C1 on sheet VLC; Device Class L3: Ceramic Capacitors; RoHS: TRUE; Octopart: https://octopart.com/c0805c104k4ractu-kemet-92155; ComponentLink2Description: Datasheet; ComponentLink2URL: https://content.kemet.com/datasheets/KEM_C1003_C0G_SMD.pdf; Temperature Range High: +125°C; Category: Cap; Lead Free: Yes; Digikey Description: CAP CER 0.1UF 16V X7R 0805; Automotive: No; Temperature Range Low: -55°C; Voltage Rating: 16 V; Package: C0805C-DN; Ipc Land Pattern Name: CAPC200125X78; Height: 0.88mm; Device Class L1: Passive Components; Temperature: -55°C to +125°C; Mouser Description: Multilayer Ceramic Capacitors MLCC - SMD/SMT 16volts 0.1uF X7R 10%; Device Class L2: Capacitors; Temperature Characteristic: X7R
P4 P9-P11 = CMP-1502-00956-3: as P1 on sheet VLC; Lead Pitch: 2mm; Max Operating Temperature: 105°C; Contact Material: Gold; Number of Rows: 1; Operating Supply Voltage: 200V; Number of Pins: 2; Orientation: Vertical; Min Operating Temperature: -40°C; Height: 6.35mm; RoHS: Non-Compliant
P5-P8 P12 P13 = CMP-1502-01058-2: NexarPartId: 32855518; Operating Supply Voltage: 250V; Connector Type: Male Pin; Contact Resistance: 20mΩ; Number of Contacts: 1; Gender: Male; Current Rating: 3A; Contact Mating Length: 5.9944mm; Number of Pins: 1; Lead Pitch: 2.54mm; Contact Plating: Gold; RoHS: Compliant; Termination: Solder; Mount: Through Hole; Number of Rows: 1; Orientation: Vertical; Contact Material: Copper; Packaging: Bulk; REACH SVHC: Unknown; Number of Positions: 1; Color: Black
Q1 Q2 = CMP-12195-000001-1: TRANS NPN 100V 3A TO-220; Manufacturer: STMicroelectronics; Hfe Max: 50; Number Of Npn: 1; Max Junction Temp: +150°C; Standoff Height: 3.5mm; Emitter Base Voltage: 5V; Collector Emitter Saturation Voltage: 1.2V; Power Dissipation: 2W; Hfe Testvce: 4V; Hfe Min: 10; Device Class L2: Transistors; ComponentLink2URL: https://www.st.com/resource/en/datasheet/tip31c.pdf; Device Class L1: Discrete Semiconductors; Digikey Description: TRANS NPN 100V 3A TO-220; Max Collector Current: 3A; RoHS: TRUE; Height: 19.68mm; Mouser Description: Bipolar Transistors - BJT NPN Gen Pur Power; Number Of Elements: 1; Package: TO-220-P0A0015988; Temperature: to +150°C; Octopart: https://octopart.com/tip31c-stmicroelectronics-15555; Manufacturer Part Number: TIP31C; Category: Trans; Hfe Testic: 3A; Lead Free: Yes; Collector Base Voltage: 100V; Device Class L3: BJTs; Collector Emitter Voltage: 100V; Automotive: No; ComponentLink2Description: Datasheet; Temperature Range High: +150°C
R1 = CMP-2001-03932-1: Manufacturer: Vishay Dale; Part Number: CRCW0805470RFKEA
R2 = CMP-07234-000048-1: as R4 on sheet Transimpedance; Resistor Type: Cermet; Color: Blue; Radiation Hardening: No; RoHS Compliant: Yes; Taper: Linear; Technology: CERMET; Mount: Panel; Packaging: Rail/Tube; Lead Free: Lead Free; Tolerance: 10%; Min Operating Temperature: -55°C; Depth: 4.83mm; Length: 9.53mm; Width: 9.53mm; REACH SVHC: No SVHC; Package Quantity: 50; Height: 0.395inch; Max Power Dissipation: 500mW; Max Operating Temperature: 125°C; Military Standard: Not; Termination: Pin; Contact Plating: Tin; Series: 3296; Weight: 0.03oz
R3 = CMP-2001-04298-2: RES Thick Film, 150Ω, 5%, 0.125W, 200ppm/°C, 0805; Power Rating: 125mW; Voltage Rating (DC): 150V; Resistance: 150R; Case/Package: 0805; Radiation Hardening: No; Packaging: Tape and Reel; Military Standard: Not; Height: 0.02inch; Case Code (Metric): 2012; Min Operating Temperature: -55°C; Contact Plating: Tin; Composition: Thick Film; Termination: SMD/SMT; Lead Free: Lead Free; Tolerance: 5%; Features: Automotive AEC-Q200; Voltage Rating: 150V; Mount: Surface Mount; Weight: 0.000194oz; Number of Terminations: 2; Length: 2mm; Max Power Dissipation: 125mW; Depth: 1.25mm; Package Quantity: 1; Case Code (Imperial): 0805; Max Operating Temperature: 155°C; Temperature Coefficient: 200ppm/°C; Width: 0.049inch
U3 = CMP-0188-01069-1: 10-Bit DACs with Internal VREF and SPI Interface, 8-Pin PDIP, Extended Temperature; ComponentLink3Description: Package Specification; ComponentLink2Description: Datasheet; Code_JEDEC: MS-001; ComponentLink1Description: Manufacturer URL; ComponentLink3URL: http://www.microchip.com/stellent/groups/techpub_sg/documents/packagingspec/en012702.pdf; ComponentLink1URL: http://www.microchip.com/; DatasheetVersion: revB, Apr-2010; PackageReference: PDIP300-P8; PackageVersion: revBB, Aug-2009; ComponentLink2URL: http://ww1.microchip.com/downloads/en/DeviceDoc/22244B.pdf; PackageDescription: 8-Lead Plastic Dual In-Line (P) - 300 mil Body [PDIP]
U4 = CMP-0187-00090-3: as U5 on sheet Transimpedance; Max Operating Temperature: 125°C; REACH SVHC: No SVHC; Height: 0.195inch; Length: 0.4inch; Min Operating Temperature: -40°C; Mount: Through Hole; Number of Amplifiers: 2; Harmonic Distortion: 0.00053%; Gain Bandwidth Product: 10MHz; RoHS Compliant: Yes; Unity Gain Bandwidth Product: 10MHz; Number of Channels: 2; Radiation Hardening: No; Technology: CMOS; Supply Current: 1mA; Package Quantity: 60; Lead Free: Lead Free; Width: 0.28inch; Slew Rate: 7V/µs; Case/Package: PDIP; Packaging: Rail/Tube; Number of Pins: 8; Number of Circuits: 2

## Sheet ModTeensy.SchDoc
size A4; SheetNumber: 2; SheetTotal: 6
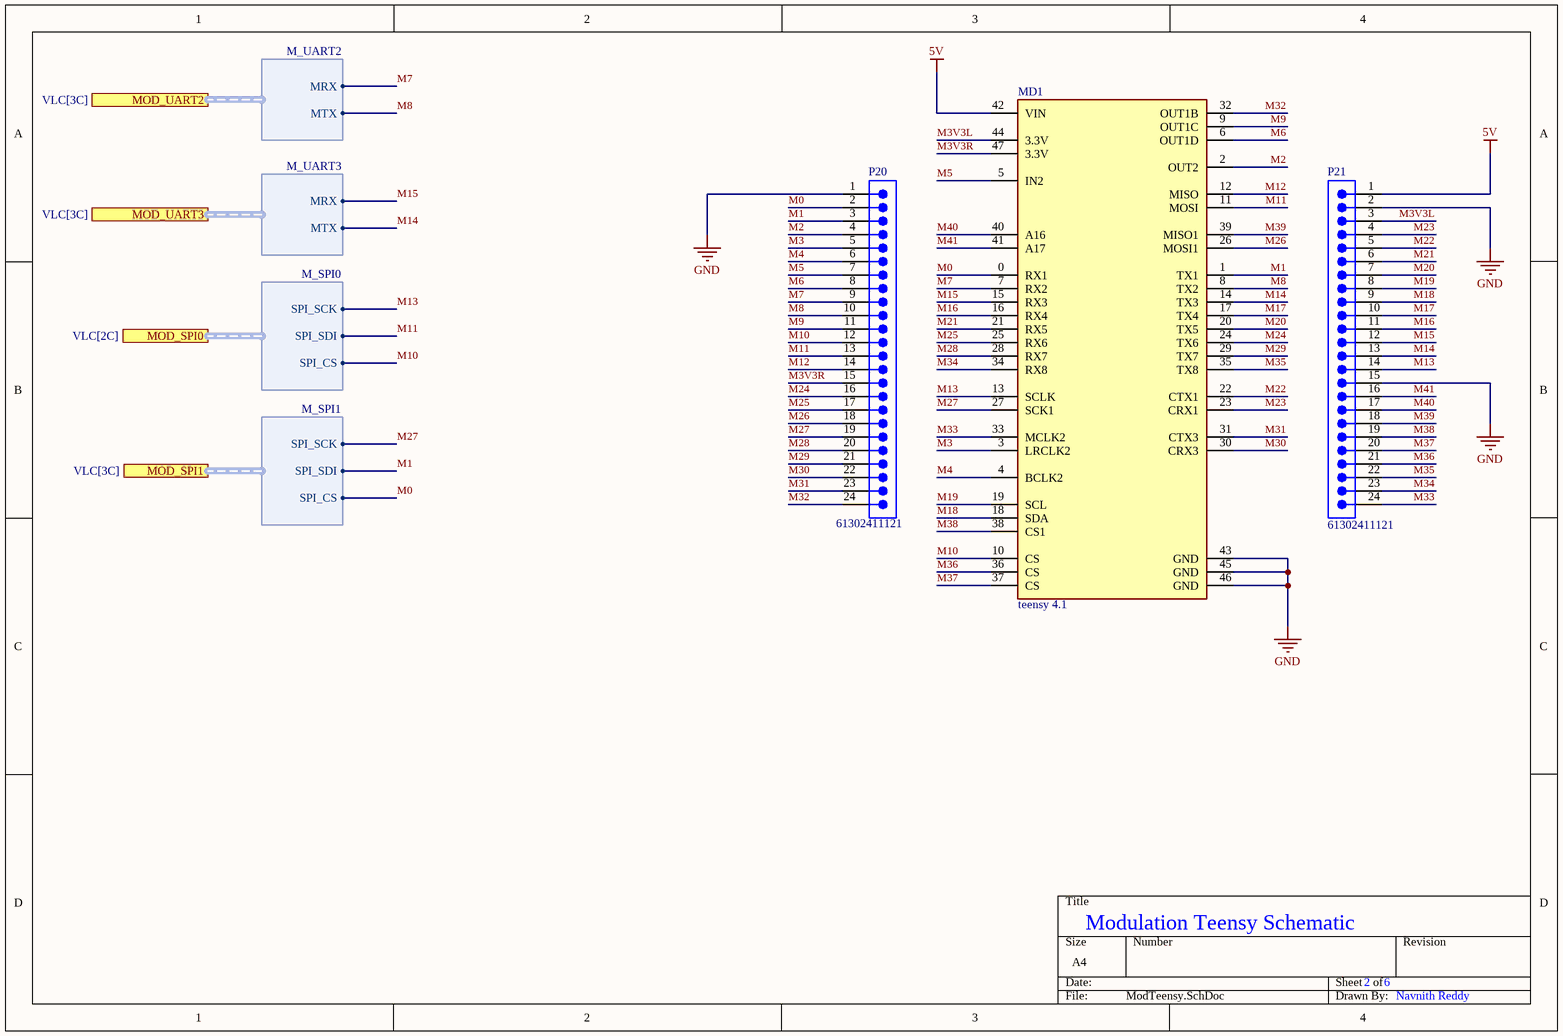
[diagram p5: ModTeensy.SchDoc]

### Parts
MD1  teensy 4.1  [FP-DEV-16996-MFG]
P20  61302411121  [61302411121]
P21  61302411121  [61302411121]

### Ports
MOD_SPI0 (harness M_SPI0, see VLC[2C]), MOD_SPI1 (harness M_SPI1, see VLC[3C]), MOD_UART2 (harness M_UART2, see VLC[3C]), MOD_UART3 (harness M_UART3, see VLC[3C])

### Harnesses
M_SPI0: SPI_SCK, SPI_SDI, SPI_CS
M_UART3: MRX, MTX
M_UART2: MRX, MTX
M_SPI1: SPI_SCK, SPI_SDI, SPI_CS

### Nets
5V: MD1.42(VIN) P21.1
GND: MD1.43(GND) MD1.45(GND) MD1.46(GND) P20.1 P21.2 P21.15
M0: MD1.0(RX1) P20.2 ; port MOD_SPI1.SPI_CS  [project net D10]
M1: MD1.1(TX1) P20.3 ; port MOD_SPI1.SPI_SDI  [project net D11]
M2: MD1.2(OUT2) P20.4
M3: MD1.3(LRCLK2) P20.5
M3V3L: MD1.44(3.3V) P21.3
M3V3R: MD1.47(3.3V) P20.15
M4: MD1.4(BCLK2) P20.6
M5: MD1.5(IN2) P20.7
M6: MD1.6(OUT1D) P20.8
M7: MD1.7(RX2) P20.9 ; port MOD_UART2.MRX  [project net D1]
M8: MD1.8(TX2) P20.10 ; port MOD_UART2.MTX  [project net D0]
M9: MD1.9(OUT1C) P20.11
M10: MD1.10(CS) P20.12 ; port MOD_SPI0.SPI_CS  [project net DAC_CS]
M11: MD1.11(MOSI) P20.13 ; port MOD_SPI0.SPI_SDI  [project net DAC_SDI]
M12: MD1.12(MISO) P20.14
M13: MD1.13(SCLK) P21.14 ; port MOD_SPI0.SPI_SCK  [project net DAC_SCK]
M14: MD1.14(TX3) P21.13 ; port MOD_UART3.MTX  [project net GPIO7]
M15: MD1.15(RX3) P21.12 ; port MOD_UART3.MRX  [project net GPIO6]
M16: MD1.16(RX4) P21.11
M17: MD1.17(TX4) P21.10
M18: MD1.18(SDA) P21.9
M19: MD1.19(SCL) P21.8
M20: MD1.20(TX5) P21.7
M21: MD1.21(RX5) P21.6
M22: MD1.22(CTX1) P21.5
M23: MD1.23(CRX1) P21.4
M24: MD1.24(TX6) P20.16
M25: MD1.25(RX6) P20.17
M26: MD1.26(MOSI1) P20.18
M27: MD1.27(SCK1) P20.19 ; port MOD_SPI1.SPI_SCK  [project net D13]
M28: MD1.28(RX7) P20.20
M29: MD1.29(TX7) P20.21
M30: MD1.30(CRX3) P20.22
M31: MD1.31(CTX3) P20.23
M32: MD1.32(OUT1B) P20.24
M33: MD1.33(MCLK2) P21.24
M34: MD1.34(RX8) P21.23
M35: MD1.35(TX8) P21.22
M36: MD1.36(CS) P21.21
M37: MD1.37(CS) P21.20
M38: MD1.38(CS1) P21.19
M39: MD1.39(MISO1) P21.18
M40: MD1.40(A16) P21.17
M41: MD1.41(A17) P21.16

### Notes on the sheet
- Modulation Teensy Schematic
- 2
- 6
- Navnith Reddy

### Library data of the parts
MD1 = CMP-157412-000001-1: TEENSY 4.1 (HEADERS)
P20 P21 = CMP-1502-01109-2: as P22 on sheet DemodTeensy; Mount: Through Hole; Contact Plating: Gold; Lead Pitch: 2.54mm; Orientation: Vertical; Color: Black; Packaging: Bulk; REACH SVHC: Unknown; Termination: Solder; Number of Positions: 24; RoHS: Compliant; Contact Mating Length: 5.9944mm; Number of Pins: 24; Contact Material: Copper; Number of Rows: 1

## Nets that join several sheets
5V: VLC (P2.2 U1.5), Pico (P25.1 U8.40), Transimpedance (10 pins), DemodTeensy (MD2.42 P23.1), Transconductance (6 pins), ModTeensy (MD1.42 P21.1)
GND: VLC (13 pins), Pico (16 pins), Transimpedance (17 pins), DemodTeensy (6 pins), Transconductance (10 pins), ModTeensy (6 pins)
PGND: VLC (9 pins), Transconductance (P13.1)
D0: DemodTeensy (MD2.0 P22.2), ModTeensy (MD1.8 P20.10)
D1: DemodTeensy (MD2.1 P22.3), ModTeensy (MD1.7 P20.9)
D7: Pico (P24.2 U8.2), DemodTeensy (MD2.7 P22.9)
D8: Pico (P24.4 U8.4), DemodTeensy (MD2.8 P22.10)
D10: DemodTeensy (MD2.10 P22.12), ModTeensy (MD1.0 P20.2)
D11: DemodTeensy (MD2.11 P22.13), ModTeensy (MD1.1 P20.3)
D13: DemodTeensy (MD2.13 P23.14), ModTeensy (MD1.27 P20.19)
D14: Pico (P25.10 U8.31), Transimpedance (R12.2 R13.2), DemodTeensy (MD2.14 P23.13)
DAC_CS: Transconductance (U3.2), ModTeensy (MD1.10 P20.12)
DAC_SCK: Transconductance (U3.3), ModTeensy (MD1.13 P21.14)
DAC_SDI: Transconductance (U3.4), ModTeensy (MD1.11 P20.13)
DIODE+: VLC (J3.2 J3.4 J4.2 J4.4), Transimpedance (R4.3 R7.1 U5.2)
GPIO6: Pico (P24.9 U8.9), ModTeensy (MD1.15 P21.12)
GPIO7: Pico (P24.10 U8.10), ModTeensy (MD1.14 P21.13)
GPIO17: Pico (P25.19 U8.22), Transimpedance (U7.1)
GPIO18: Pico (P25.17 U8.24), Transimpedance (U7.2)
GPIO19: Pico (P25.16 U8.25), Transimpedance (U7.3)
LED-: VLC (J5.1 J5.3), Transconductance (Q2.2)